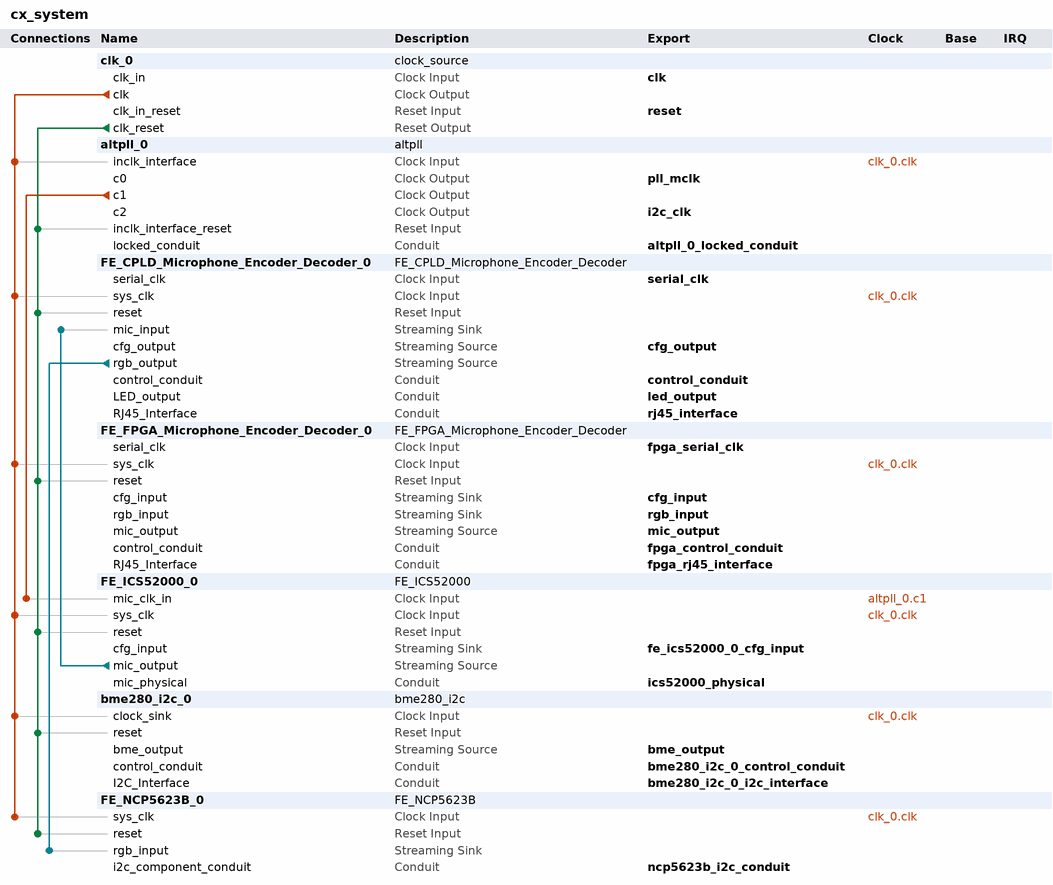
[diagram p0: system contents]
# Platform Designer (Qsys) system cx_system, MAX 10 10M08SAE144C8GES
# Parameters at their usual value, and those the tool derives, are not listed.
package require -exact qsys 18.0
create_system cx_system
set_project_property DEVICE_FAMILY {MAX 10}
set_project_property DEVICE 10M08SAE144C8GES

add_instance clk_0 clock_source 18.0
set_instance_parameter_value clk_0 clockFrequency 50000000

add_instance altpll_0 altpll 18.0
set_instance_parameter_value altpll_0 CLK0_DIVIDE_BY 3125
set_instance_parameter_value altpll_0 CLK0_MULTIPLY_BY 768
set_instance_parameter_value altpll_0 CLK1_DIVIDE_BY 3125
set_instance_parameter_value altpll_0 CLK1_DUTY_CYCLE 50
set_instance_parameter_value altpll_0 CLK1_MULTIPLY_BY 192
set_instance_parameter_value altpll_0 CLK1_PHASE_SHIFT 0
set_instance_parameter_value altpll_0 CLK2_DIVIDE_BY 5
set_instance_parameter_value altpll_0 CLK2_DUTY_CYCLE 50
set_instance_parameter_value altpll_0 CLK2_MULTIPLY_BY 3
set_instance_parameter_value altpll_0 CLK2_PHASE_SHIFT 0
set_instance_parameter_value altpll_0 INCLK0_INPUT_FREQUENCY 20000
set_instance_parameter_value altpll_0 PORT_ARESET PORT_UNUSED
set_instance_parameter_value altpll_0 PORT_LOCKED PORT_USED
set_instance_parameter_value altpll_0 PORT_clk1 PORT_USED
set_instance_parameter_value altpll_0 PORT_clk2 PORT_USED
set_instance_parameter_value altpll_0 PORT_clk3 PORT_UNUSED

add_instance FE_CPLD_Microphone_Encoder_Decoder_0 FE_CPLD_Microphone_Encoder_Decoder 1.0
set_instance_parameter_value FE_CPLD_Microphone_Encoder_Decoder_0 avalon_data_width 32
set_instance_parameter_value FE_CPLD_Microphone_Encoder_Decoder_0 bme_data_width 96
set_instance_parameter_value FE_CPLD_Microphone_Encoder_Decoder_0 cfg_data_width 16
set_instance_parameter_value FE_CPLD_Microphone_Encoder_Decoder_0 ch_width 5
set_instance_parameter_value FE_CPLD_Microphone_Encoder_Decoder_0 mic_data_width 24
set_instance_parameter_value FE_CPLD_Microphone_Encoder_Decoder_0 n_mics 16
set_instance_parameter_value FE_CPLD_Microphone_Encoder_Decoder_0 rgb_data_width 16

add_instance FE_FPGA_Microphone_Encoder_Decoder_0 FE_FPGA_Microphone_Encoder_Decoder 1.0
set_instance_parameter_value FE_FPGA_Microphone_Encoder_Decoder_0 avalon_data_width 32
set_instance_parameter_value FE_FPGA_Microphone_Encoder_Decoder_0 bme_data_width 96
set_instance_parameter_value FE_FPGA_Microphone_Encoder_Decoder_0 cfg_data_width 16
set_instance_parameter_value FE_FPGA_Microphone_Encoder_Decoder_0 ch_width 4
set_instance_parameter_value FE_FPGA_Microphone_Encoder_Decoder_0 mic_data_width 24
set_instance_parameter_value FE_FPGA_Microphone_Encoder_Decoder_0 n_mics 16
set_instance_parameter_value FE_FPGA_Microphone_Encoder_Decoder_0 rgb_data_width 16

add_instance FE_ICS52000_0 FE_ICS52000 1.0
set_instance_parameter_value FE_ICS52000_0 avalon_data_width 32
set_instance_parameter_value FE_ICS52000_0 cfg_data_width 16
set_instance_parameter_value FE_ICS52000_0 ch_width 6
set_instance_parameter_value FE_ICS52000_0 mic_data_width 24
set_instance_parameter_value FE_ICS52000_0 n_clocks 4
set_instance_parameter_value FE_ICS52000_0 n_mics 16
set_instance_parameter_value FE_ICS52000_0 sck_multiplier 64

add_instance bme280_i2c_0 bme280_i2c 1.0
set_instance_parameter_value bme280_i2c_0 input_clk 50000000
set_instance_parameter_value bme280_i2c_0 reads_per_second 16
set_instance_parameter_value bme280_i2c_0 sdo 0

add_instance FE_NCP5623B_0 FE_NCP5623B 1.0

# connections
add_connection altpll_0.c1 FE_ICS52000_0.mic_clk_in clock
add_connection clk_0.clk altpll_0.inclk_interface clock
add_connection clk_0.clk bme280_i2c_0.clock_sink clock
add_connection clk_0.clk FE_CPLD_Microphone_Encoder_Decoder_0.sys_clk clock
add_connection clk_0.clk FE_FPGA_Microphone_Encoder_Decoder_0.sys_clk clock
add_connection clk_0.clk FE_ICS52000_0.sys_clk clock
add_connection clk_0.clk FE_NCP5623B_0.sys_clk clock
add_connection clk_0.clk_reset altpll_0.inclk_interface_reset reset
add_connection clk_0.clk_reset bme280_i2c_0.reset reset
add_connection clk_0.clk_reset FE_CPLD_Microphone_Encoder_Decoder_0.reset reset
add_connection clk_0.clk_reset FE_FPGA_Microphone_Encoder_Decoder_0.reset reset
add_connection clk_0.clk_reset FE_ICS52000_0.reset reset
add_connection clk_0.clk_reset FE_NCP5623B_0.reset reset
add_connection FE_CPLD_Microphone_Encoder_Decoder_0.rgb_output FE_NCP5623B_0.rgb_input avalon_streaming
add_connection FE_ICS52000_0.mic_output FE_CPLD_Microphone_Encoder_Decoder_0.mic_input avalon_streaming

# exported interfaces
add_interface altpll_0_locked_conduit conduit end
set_interface_property altpll_0_locked_conduit EXPORT_OF altpll_0.locked_conduit
add_interface bme280_i2c_0_control_conduit conduit end
set_interface_property bme280_i2c_0_control_conduit EXPORT_OF bme280_i2c_0.control_conduit
add_interface bme280_i2c_0_i2c_interface conduit end
set_interface_property bme280_i2c_0_i2c_interface EXPORT_OF bme280_i2c_0.I2C_Interface
add_interface bme_output avalon_streaming source
set_interface_property bme_output EXPORT_OF bme280_i2c_0.bme_output
add_interface cfg_input avalon_streaming sink
set_interface_property cfg_input EXPORT_OF FE_FPGA_Microphone_Encoder_Decoder_0.cfg_input
add_interface cfg_output avalon_streaming source
set_interface_property cfg_output EXPORT_OF FE_CPLD_Microphone_Encoder_Decoder_0.cfg_output
add_interface clk clock sink
set_interface_property clk EXPORT_OF clk_0.clk_in
add_interface control_conduit conduit end
set_interface_property control_conduit EXPORT_OF FE_CPLD_Microphone_Encoder_Decoder_0.control_conduit
add_interface fe_ics52000_0_cfg_input avalon_streaming sink
set_interface_property fe_ics52000_0_cfg_input EXPORT_OF FE_ICS52000_0.cfg_input
add_interface fpga_control_conduit conduit end
set_interface_property fpga_control_conduit EXPORT_OF FE_FPGA_Microphone_Encoder_Decoder_0.control_conduit
add_interface fpga_rj45_interface conduit end
set_interface_property fpga_rj45_interface EXPORT_OF FE_FPGA_Microphone_Encoder_Decoder_0.RJ45_Interface
add_interface fpga_serial_clk clock sink
set_interface_property fpga_serial_clk EXPORT_OF FE_FPGA_Microphone_Encoder_Decoder_0.serial_clk
add_interface i2c_clk clock source
set_interface_property i2c_clk EXPORT_OF altpll_0.c2
add_interface ics52000_physical conduit end
set_interface_property ics52000_physical EXPORT_OF FE_ICS52000_0.mic_physical
add_interface led_output conduit end
set_interface_property led_output EXPORT_OF FE_CPLD_Microphone_Encoder_Decoder_0.LED_output
add_interface mic_output avalon_streaming source
set_interface_property mic_output EXPORT_OF FE_FPGA_Microphone_Encoder_Decoder_0.mic_output
add_interface ncp5623b_i2c_conduit conduit end
set_interface_property ncp5623b_i2c_conduit EXPORT_OF FE_NCP5623B_0.i2c_component_conduit
add_interface pll_mclk clock source
set_interface_property pll_mclk EXPORT_OF altpll_0.c0
add_interface reset reset sink
set_interface_property reset EXPORT_OF clk_0.clk_in_reset
add_interface rgb_input avalon_streaming sink
set_interface_property rgb_input EXPORT_OF FE_FPGA_Microphone_Encoder_Decoder_0.rgb_input
add_interface rj45_interface conduit end
set_interface_property rj45_interface EXPORT_OF FE_CPLD_Microphone_Encoder_Decoder_0.RJ45_Interface
add_interface serial_clk clock sink
set_interface_property serial_clk EXPORT_OF FE_CPLD_Microphone_Encoder_Decoder_0.serial_clk

set_interconnect_requirement {$system} qsys_mm.clockCrossingAdapter HANDSHAKE
set_interconnect_requirement {$system} qsys_mm.enableEccProtection FALSE
set_interconnect_requirement {$system} qsys_mm.insertDefaultSlave FALSE
set_interconnect_requirement {$system} qsys_mm.maxAdditionalLatency 1

save_system cx_system.qsys
